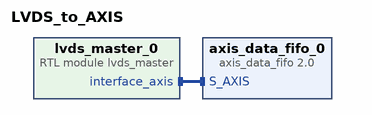
[diagram p0: block diagram of the top level]
# Vivado block design LVDS_to_AXIS, xc7z020clg484-1, Vivado 2024.2
create_bd_design LVDS_to_AXIS

create_bd_cell -type ip -vlnv xilinx.com:ip:axis_data_fifo:2.0 axis_data_fifo_0
set_property -dict {CONFIG.TDATA_NUM_BYTES 6} [get_bd_cells axis_data_fifo_0]
create_bd_cell -type module -reference lvds_master lvds_master_0

# ---- connections ----

connect_bd_intf_net [get_bd_intf_pins lvds_master_0/interface_axis] [get_bd_intf_pins axis_data_fifo_0/S_AXIS]

validate_bd_design
save_bd_design
